# Altium schematic sheet FFT-STM32.SchDoc
size A3
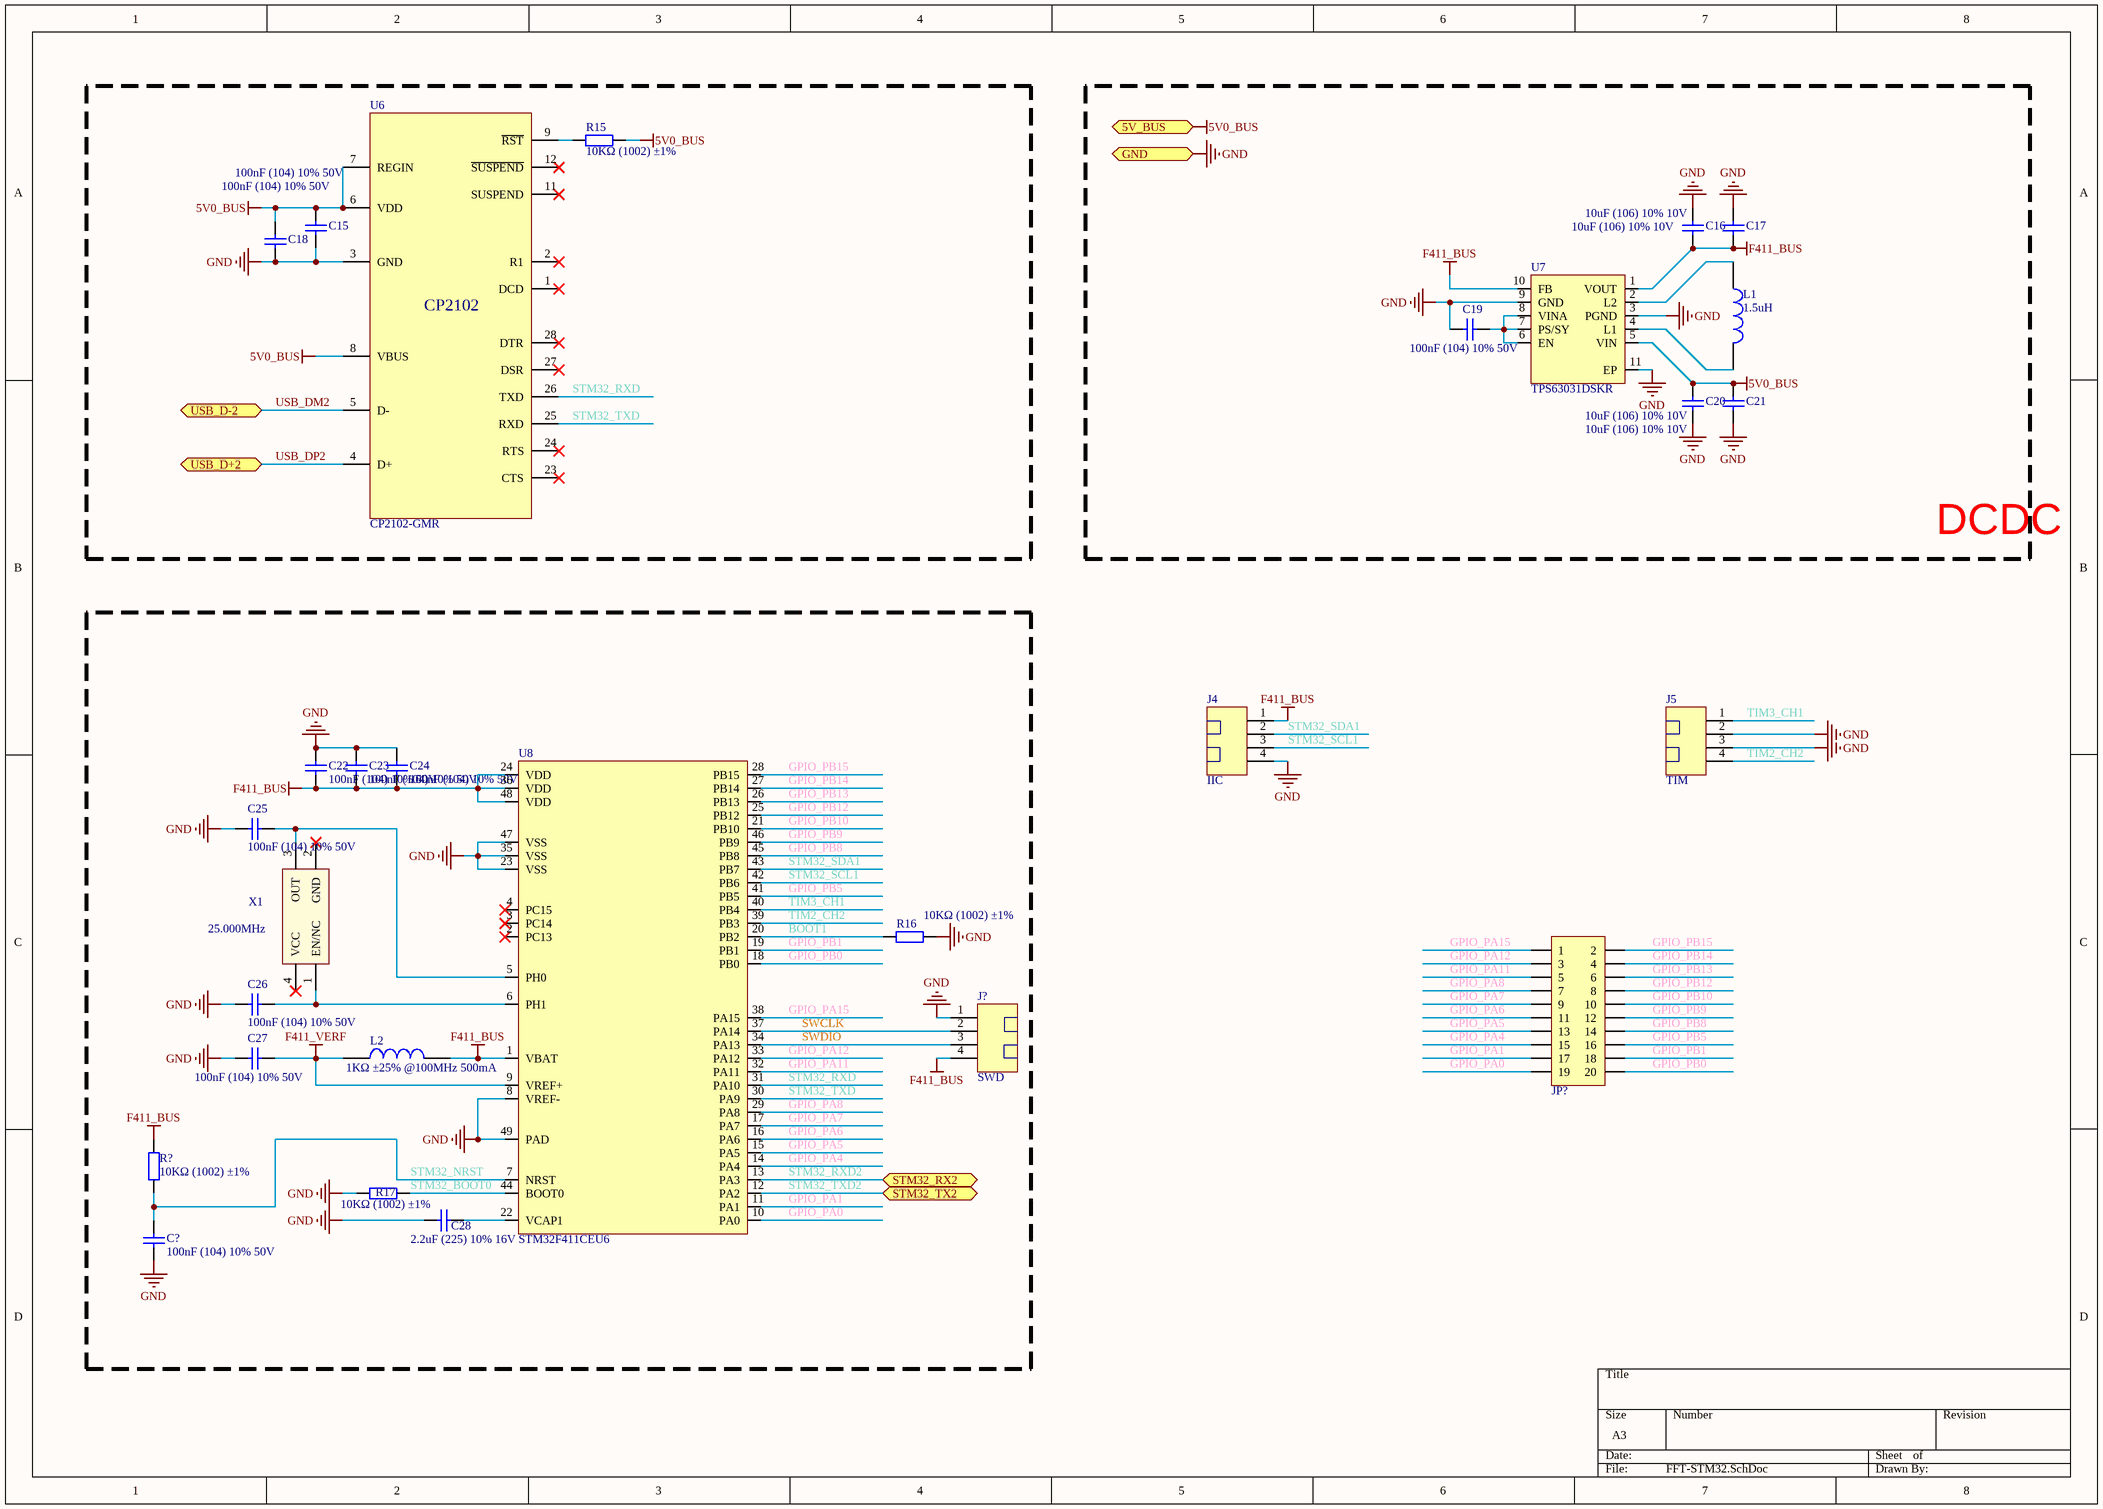
[diagram p0: FFT-STM32.SchDoc]

## Parts
C15  100nF (104) 10% 50V  [LC-0603_C]
C16  10uF (106) 10% 10V  [LC-0603_C]
C17  10uF (106) 10% 10V  [LC-0603_C]
C18  100nF (104) 10% 50V  [LC-0603_C]
C19  100nF (104) 10% 50V  [LC-0603_C]
C20  10uF (106) 10% 10V  [LC-0603_C]
C21  10uF (106) 10% 10V  [LC-0603_C]
C22  100nF (104) 10% 50V  [LC-0603_C]
C23  100nF (104) 10% 50V  [LC-0603_C]
C24  100nF (104) 10% 50V  [LC-0603_C]
C25  100nF (104) 10% 50V  [LC-0603_C]
C26  100nF (104) 10% 50V  [LC-0603_C]
C27  100nF (104) 10% 50V  [LC-0603_C]
C28  2.2uF (225) 10% 16V  [LC-0603_C]
C?  100nF (104) 10% 50V  [LC-0603_C]
J4  IIC  [MX1.25WS-4P]
J5  TIM  [MX1.25WS-4P]
J?  SWD  [Header 1.27X4]
JP?  Header 2X10  [HDR2.54-LI-2x10P]  (value not drawn)
L1  1.5uH  [0603L]
L2  1KΩ ±25% @100MHz 500mA  [0603L]
R15  10KΩ (1002) ±1%  [LC-0603_R]
R16  10KΩ (1002) ±1%  [LC-0603_R]
R17  10KΩ (1002) ±1%  [LC-0603_R]
R?  10KΩ (1002) ±1%  [LC-0603_R]
U6  CP2102-GMR  [QFN28_5X5]
U7  TPS63031DSKR  [WSON10]
U8  STM32F411CEU6  [QFN48_7X7]
X1  25.000MHz  [OSC 3225-4P]

## Blocks framed on the sheet
DCDC: C16 C17 C19-C21 L1 U7

## Ports
5V_BUS, GND, STM32_RX2, STM32_TX2, USB_D+2, USB_D-2

## Nets
5V0_BUS: C15.1 C18.1 C20.2 C21.1 R15.2 U6.6(VDD) U6.7(REGIN) U6.8(VBUS) U7.5(VIN) ; port 5V_BUS
F411_BUS: C16.1 C17.2 C22.2 C23.2 C24.2 J4.1 J?.4 L2.2 R?.2 U7.1(VOUT) U7.10(FB) U8.1(VBAT) U8.24(VDD) U8.36(VDD) U8.48(VDD)
F411_VERF: C27.1 L2.1 U8.9(VREF+)
GND: C15.2 C16.2 C17.1 C18.2 C19.2 C20.1 C21.2 C22.1 C23.1 C24.1 C25.1 C26.1 C27.2 C28.1 C?.2 J4.4 J5.2 J5.3 J?.1 R16.2 R17.1 U6.3(GND) U7.3(PGND) U7.9(GND) U7.11(EP) U8.8(VREF-) U8.23(VSS) U8.35(VSS) U8.47(VSS) U8.49(PAD) ; port GND
BOOT1: R16.1 U8.20(PB2)
GPIO_PA0: JP?.19 U8.10(PA0)
GPIO_PA1: JP?.17 U8.11(PA1)
GPIO_PA4: JP?.15 U8.14(PA4)
GPIO_PA5: JP?.13 U8.15(PA5)
GPIO_PA6: JP?.11 U8.16(PA6)
GPIO_PA7: JP?.9 U8.17(PA7)
GPIO_PA8: JP?.7 U8.29(PA8)
GPIO_PA11: JP?.5 U8.32(PA11)
GPIO_PA12: JP?.3 U8.33(PA12)
GPIO_PA15: JP?.1 U8.38(PA15)
GPIO_PB0: JP?.20 U8.18(PB0)
GPIO_PB1: JP?.18 U8.19(PB1)
GPIO_PB5: JP?.16 U8.41(PB5)
GPIO_PB8: JP?.14 U8.45(PB8)
GPIO_PB9: JP?.12 U8.46(PB9)
GPIO_PB10: JP?.10 U8.21(PB10)
GPIO_PB12: JP?.8 U8.25(PB12)
GPIO_PB13: JP?.6 U8.26(PB13)
GPIO_PB14: JP?.4 U8.27(PB14)
GPIO_PB15: JP?.2 U8.28(PB15)
STM32_BOOT0: R17.2 U8.44(BOOT0)
STM32_NRST: C?.1 R?.1 U8.7(NRST)
STM32_RXD: U6.26(TXD) U8.31(PA10)
STM32_RXD2: U8.13(PA3) ; port STM32_RX2
STM32_SCL1: J4.3 U8.42(PB6)
STM32_SDA1: J4.2 U8.43(PB7)
STM32_TXD: U6.25(RXD) U8.30(PA9)
STM32_TXD2: U8.12(PA2) ; port STM32_TX2
SWCLK: J?.2 U8.37(PA14)
SWDIO: J?.3 U8.34(PA13)
TIM2_CH2: J5.4 U8.39(PB3)
TIM3_CH1: J5.1 U8.40(PB4)
USB_DM2: U6.5(D-) ; port USB_D-2
USB_DP2: U6.4(D+) ; port USB_D+2
NetC19_1: C19.1 U7.6(EN) U7.7(PS/SY) U7.8(VINA)
NetC25_2: C25.2 U8.5(PH0) X1.3(OUT)
NetC26_2: C26.2 U8.6(PH1) X1.1(EN/NC)
NetC28_2: C28.2 U8.22(VCAP1)
NetL1_1: L1.1 U7.4(L1)
NetL1_2: L1.2 U7.2(L2)
NetR15_1: R15.1 U6.9(~{RST})

Not connected (* = marked no-connect by the designer): U6 1(DCD)* 2(R1)* 11(SUSPEND)* 12(~{SUSPEND})* 23(CTS)* 24(RTS)* 27(DSR)* 28(DTR)*; U8 2(PC13)* 3(PC14)* 4(PC15)*; X1 2(GND)* 4(VCC)*

## Notes on the sheet
- (in symbol CP2102-GMR) CP2102

## Library data of the parts
C15 C18 C19 C22-C27 C? = 0603 100nF (104) 10% 50V: 贴片电容; ComponentLink1Description: 供应商链接; ComponentLink1URL: http://www.szlcsc.com/product/details_15331.html; Package: 0603; Supplier: LC; SuppliersPartNumber: C14663
C16 C17 C20 C21 = 0603 10uF (106) 10% 10V: 贴片电容; ComponentLink1Description: 供应商链接; ComponentLink1URL: http://www.szlcsc.com/product/details_20411.html; Package: 0603; Supplier: LC; SuppliersPartNumber: C19702
C28 = 0603 2.2uF (225) 10% 16V: 贴片电容; ComponentLink1Description: 供应商链接; ComponentLink1URL: http://www.szlcsc.com/product/details_24366.html; Package: 0603; Supplier: LC; SuppliersPartNumber: C23630
J4 J5 J? = MX1.25-4P
JP? = Header 10X2: 10*2P接插件; 版权归属: 源创客; BOM名称: 10*2P接插件; 学习资源: www.ooocke.com
L1 L2 = INDUCTOR
R15-R17 R? = 0603 10KΩ (1002) 1%: 贴片电阻; ComponentLink1Description: 供应商链接; ComponentLink1URL: http://www.szlcsc.com/product/details_26547.html; Package: 0603; Supplier: LC; SuppliersPartNumber: C25804
U6 = CP2102-GMR: USB; ComponentLink1Description: 供应商链接; ComponentLink1URL: http://www.szlcsc.com/product/details_7033.html; Package: QFN-28_5x5x05P; Supplier: LC; SuppliersPartNumber: C6568
U7 = TPS63031DSKR: TPS63031DSKR DCDC
X1 = XTAL-ACT-4P: 4脚有源晶振